# Altium schematic sheet Power.SchDoc
size A4; Revision: B.2
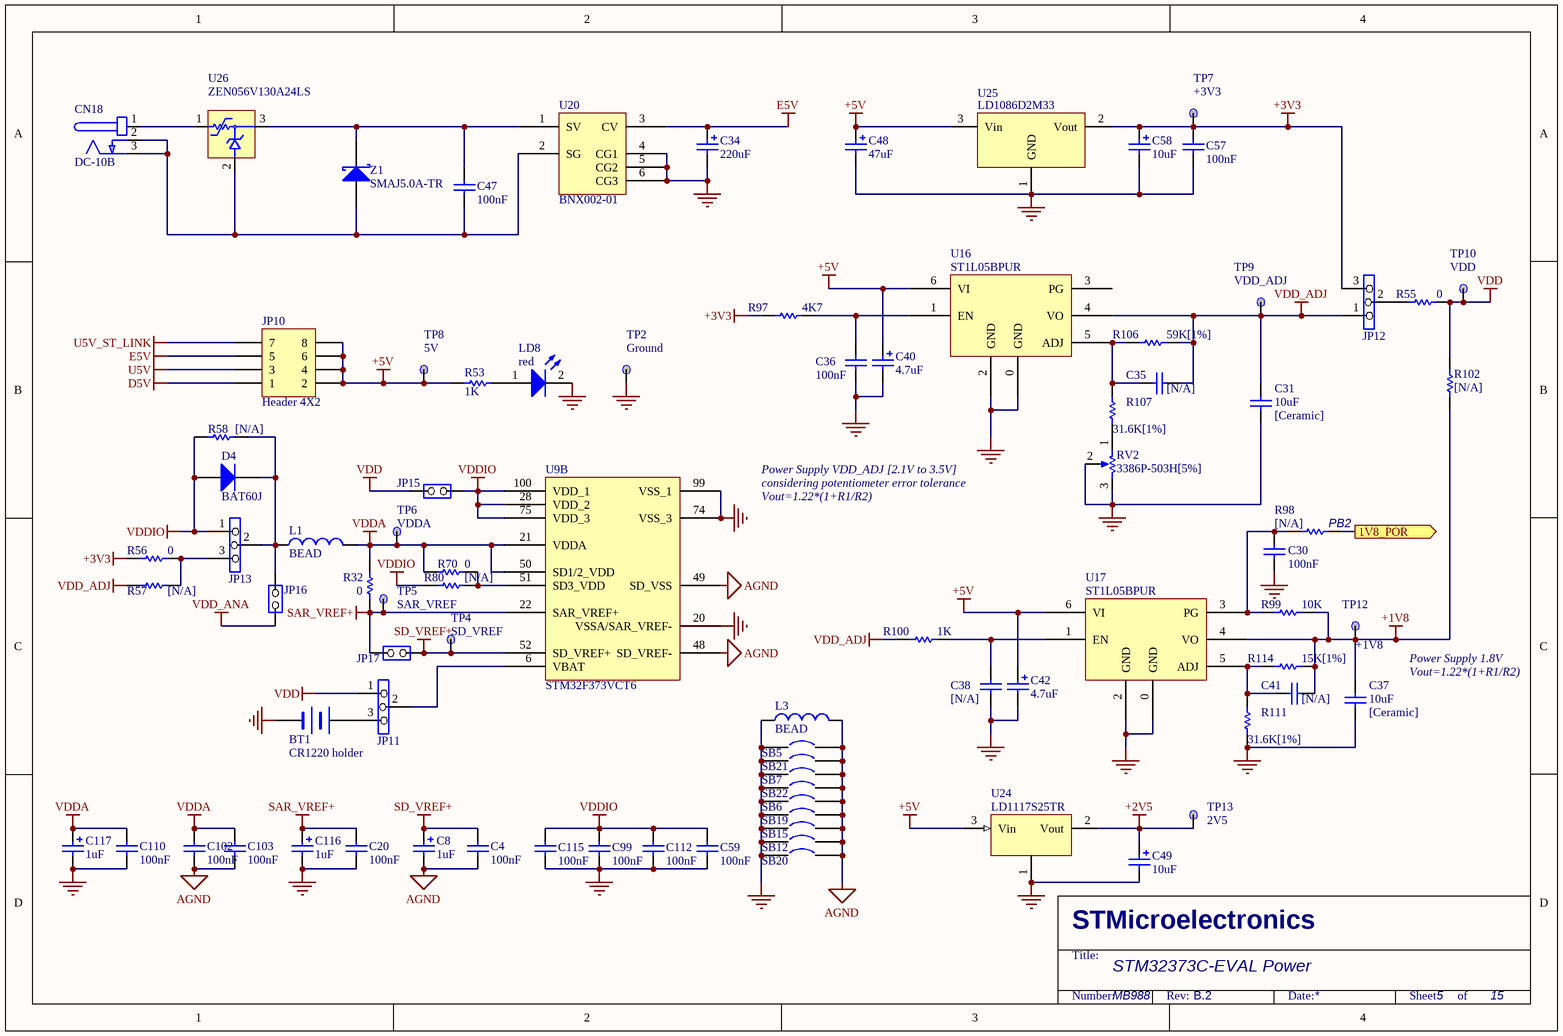
[diagram p0: Power.SchDoc]

## Parts
BT1  CR1220 holder  [LI1220_1]
C4  100nF  [0603C]
C8  1uF  [TAN-A]
C20  100nF  [0603C]
C30  100nF  [0603C]
C31  10uF  [0805C]
C34  220uF  [C310M]
C35  [N/A]  [0603C]
C36  100nF  [0603C]
C37  10uF  [0805C]
C38  [N/A]  [0603C]
C40  4.7uF  [TAN-A]
C41  [N/A]  [0603C]
C42  4.7uF  [TAN-A]
C47  100nF  [0603C]
C48  47uF  [C200M]
C49  10uF  [TAN-A]
C57  100nF  [0603C]
C58  10uF  [TAN-A]
C59  100nF  [0603C]
C99  100nF  [0603C]
C102  100nF  [0603C]
C103  100nF  [0603C]
C110  100nF  [0603C]
C112  100nF  [0603C]
C115  100nF  [0603C]
C116  1uF  [TAN-A]
C117  1uF  [TAN-A]
CN18  DC-10B  [DC10B]
D4  BAT60J  [SOD-323]
JP10  Header 4X2  [2*4P]
JP11  (no value)  [SIP3]
JP12  (no value)  [SIP3]
JP13  (no value)  [SIP3]
JP15  (no value)  [SIP2]
JP16  (no value)  [SIP2]
JP17  (no value)  [SIP2]
L1  BEAD  [0603L]
L3  BEAD  [0603L]
LD8  red  [0603D]
R32  0  [0603R]
R53  1K  [0603R]
R55  0  [0603R]
R56  0  [0603R]
R57  [N/A]  [0603R]
R58  [N/A]  [0603R]
R70  0  [0603R]
R80  [N/A]  [0603R]
R97  4K7  [0603R]
R98  [N/A]  [0603R]
R99  10K  [0603R]
R100  1K  [0603R]
R102  [N/A]  [0603R]
R106  59K[1%]  [0603R]
R107  31.6K[1%]  [0603R]
R111  31.6K[1%]  [0603R]
R114  15K[1%]  [0603R]
RV2  3386P-503H[5%]  [3296W]
SB5  (no value)  [JP2_SMD]
SB6  (no value)  [JP2_SMD]
SB7  (no value)  [JP2_SMD]
SB12  (no value)  [JP2_SMD]
SB15  (no value)  [JP2_SMD]
SB19  (no value)  [JP2_SMD]
SB20  (no value)  [JP2_SMD]
SB21  (no value)  [JP2_SMD]
SB22  (no value)  [JP2_SMD]
TP2  Ground  [TP]
TP4  SD_VREF  [TP]
TP5  SAR_VREF  [TP]
TP6  VDDA  [TP]
TP7  +3V3  [TP]
TP8  5V  [TP]
TP9  VDD_ADJ  [TP]
TP10  VDD  [TP]
TP12  +1V8  [TP]
TP13  2V5  [TP]
U9  STM32F373VCT6  [IC149-100-025-B5]  (part B of 2)
U16  ST1L05BPUR  [DFN6(3X3)]
U17  ST1L05BPUR  [DFN6(3X3)]
U20  BNX002-01  [BNX001]
U24  LD1117S25TR  [SOT-223]
U25  LD1086D2M33  [D2PAK/A]
U26  ZEN056V130A24LS  [polyzen]
Z1  SMAJ5.0A-TR  [1R1C]

## Ports
1V8_POR (out)

## Nets
+1V8: C37.1 C41.2 R99.2 R102.2 R114.1 TP12.1 U17.4(VO)
+2V5: C49.1 TP13.1 U24.2(Vout)
+3V3: C57.1 C58.1 JP12.3 R56.2 R97.2 TP7.1 U25.2(Vout)
+5V: C40.1 C42.1 C48.1 JP10.2 JP10.4 JP10.6 JP10.8 R53.2 TP8.1 U16.6(VI) U17.6(VI) U24.3(Vin) U25.3(Vin)
AGND: C4.1 C8.2 C102.1 C103.1 L3.2 SB5.2 SB6.2 SB7.2 SB12.2 SB15.2 SB19.2 SB20.2 SB21.2 SB22.2 U9.48(SD_VREF-) U9.49(SD_VSS)
D5V: JP10.1
E5V: C34.1 JP10.5 U20.3(CV)
GND: BT1.2(-) C20.1 C30.2 C31.2 C34.2 C36.2 C37.2 C38.2 C40.2 C42.2 C48.2 C49.2 C57.2 C58.2 C59.2 C99.2 C110.1 C112.2 C115.2 C116.2 C117.2 L3.1 LD8.2(K) R111.2 RV2.2(TAP) RV2.3(TOP) SB5.1 SB6.1 SB7.1 SB12.1 SB15.1 SB19.1 SB20.1 SB21.1 SB22.1 TP2.1 U9.20(VSSA/SAR_VREF-) U9.74(VSS_3) U9.99(VSS_1) U16.0(GND) U16.2(GND) U17.0(GND) U17.2(GND) U20.4(CG1) U20.5(CG2) U20.6(CG3) U24.1 U25.1(GND)
SAR_VREF+: C20.2 C116.1 JP17.2(NO) R32.2 TP5.1 U9.22(SAR_VREF+)
SD_VREF+: C4.2 C8.1 JP17.1(COMMON) TP4.1 U9.52(SD_VREF+)
U5V: JP10.3
U5V_ST_LINK: JP10.7
VDD: JP11.1 JP15.2(NO) R55.1 R102.1 TP10.1
VDD_ADJ: C31.1 C35.2 JP12.1 R57.2 R100.2 R106.1 TP9.1 U16.4(VO)
VDD_ANA: JP16.1(COMMON)
VDDA: C102.2 C103.2 C110.2 C117.1 L1.2 R32.1 R70.1 TP6.1 U9.21(VDDA) U9.50(SD1/2_VDD)
VDDIO: C59.1 C99.1 C112.1 C115.1 D4.1(A) JP13.1 JP15.1(COMMON) R58.1 R80.1 U9.28(VDD_2) U9.75(VDD_3) U9.100(VDD_1)
1V8_POR: R98.1 ; port 1V8_POR
NetBT1_1: BT1.1(+) JP11.3
NetC30_1: C30.1 R98.2 R99.1 U17.3(PG)
NetC35_1: C35.1 R106.2 R107.1 U16.5(ADJ)
NetC36_1: C36.1 R97.1 U16.1(EN)
NetC38_1: C38.1 R100.1 U17.1(EN)
NetC41_1: C41.1 R111.1 R114.2 U17.5(ADJ)
NetC47_1: C47.1 U20.1(SV) U26.3 Z1.2(K)
NetC47_2: C47.2 CN18.2(GND) CN18.3(GND) U20.2(SG) U26.2 Z1.1(A)
NetCN18_1: CN18.1(+) U26.1
NetD4_2: D4.2(K) JP13.2 JP16.2(NO) L1.1 R58.2
NetJP11_2: JP11.2 U9.6(VBAT)
NetJP12_2: JP12.2 R55.2
NetJP13_3: JP13.3 R56.1 R57.1
NetLD8_1: LD8.1(A) R53.1
NetR70_2: R70.2 R80.2 U9.51(SD3_VDD)
NetR107_2: R107.2 RV2.1(BOT)

Not connected (* = marked no-connect by the designer): U16 3(PG)

## Notes on the sheet
- (near C31) [Ceramic]
- Power Supply VDD_ADJ [2.1V to 3.5V]
- Vout=1.22*(1+R1/R2)
- considering potentiometer error tolerance
- (near R98) PB2
- (near C37) [Ceramic]
- Power Supply 1.8V
- STM32373C-EVAL Power
- MB988
- 5
- 15
- STMicroelectronics
- Title:
- Number:
- Rev:
- Date:
- Sheet       of

## Library data of the parts
BT1 = BATTERY
C4 C20 C30 C31 C35-C38 C41 C57 C102 C103 C110 = Cap: Capacitor; Value: 10nF; Published: 8-Jun-2000; Revision: July-2002: Re-released for DXP Platform.; Publisher: Altium Limited
C8 C48 C116 C117 = Cap Pol1: Polarized Capacitor (Radial); Value: 10uF; Published: 8-Jun-2000; Revision: July-2002: Re-released for DXP Platform.; Publisher: Altium Limited
C34 = Cap Pol1: Polarized Capacitor (Radial); Value: 47uF; Published: 8-Jun-2000; Revision: July-2002: Re-released for DXP Platform.; Publisher: Altium Limited
C40 C42 = Cap Pol1: Polarized Capacitor (Radial); Value: 100pF; Published: 8-Jun-2000; Revision: July-2002: Re-released for DXP Platform.; Publisher: Altium Limited
C47 = CAP: Capacitor; Value: 100pF; Published: 8-Jun-2000; Revision: July-2002: Re-released for DXP Platform.; Publisher: Altium Limited
C49 C58 = Cap Pol1: Polarized Capacitor (Radial); Published: 8-Jun-2000; Revision: July-2002: Re-released for DXP Platform.; Publisher: Altium Limited; Value: 10uF
C59 C99 C112 C115 = CAP: Capacitor; Published: 8-Jun-2000; Revision: July-2002: Re-released for DXP Platform.; Publisher: Altium Limited; Value: 100nF
CN18 = PJ202A
D4 = Diode: Default Diode; Code - JEDEC: DO-214-AB; Published: 8-Jun-2000; Revision: July-2002: Re-released for DXP Platform.; Publisher: Altium Limited
JP10 = Header 4X2: Header, 4-Pin, Dual row; Revision: 17-Jul-2002: Re-released for DXP Platform.; Publisher: Altium Limited
JP11-JP13 = Jumper3
JP15-JP17 = JP2
L1 L3 = Inductor: Value: 100uH; Published: 8-Jun-2000; Revision: July-2002: Re-released for DXP Platform.; Publisher: Altium Limited
LD8 = LED2: Typical RED, GREEN, YELLOW, AMBER GaAs LED; Published: 8-Jun-2000; Revision: July-2002: Re-released for DXP Platform.; Publisher: Altium Limited
R32 R55-R58 R70 R80 R98 R102 R106 R107 R111 R114 = Res1: Resistor; Value: 1K; Published: 8-Jun-2000; Revision: July-2002: Re-released for DXP Platform.; Publisher: Altium Limited
R53 R100 = res1: Resistor; Published: 8-Jun-2000; Revision: July-2002: Re-released for DXP Platform.; Publisher: Altium Limited; Value: 1K
R97 R99 = res1: Resistor; Value: 1K; Published: 8-Jun-2000; Revision: July-2002: Re-released for DXP Platform.; Publisher: Altium Limited
RV2 = RV
SB5-SB7 SB12 SB15 SB19-SB22 = Circuit Breaker: Published: 24-Mar-1999; Revision: July-2002: Re-released for DXP Platform.; Publisher: Altium Limited
TP2 TP4-TP10 TP12 TP13 = TP
U9 = Goldfish
U16 U17 = ST1L05
U20 = BNX002
U24 = LD1117
U25 = VOLTREG1
Z1 = D Schottky: Schottky Diode; Code - JEDEC: DO-214-AA; Published: 8-Jun-2000; Revision: July-2002: Re-released for DXP Platform.; Publisher: Altium Limited